# EAGLE design XstractiK_Domination_Player_Forearm_V1 (EAGLE 9.7.0)
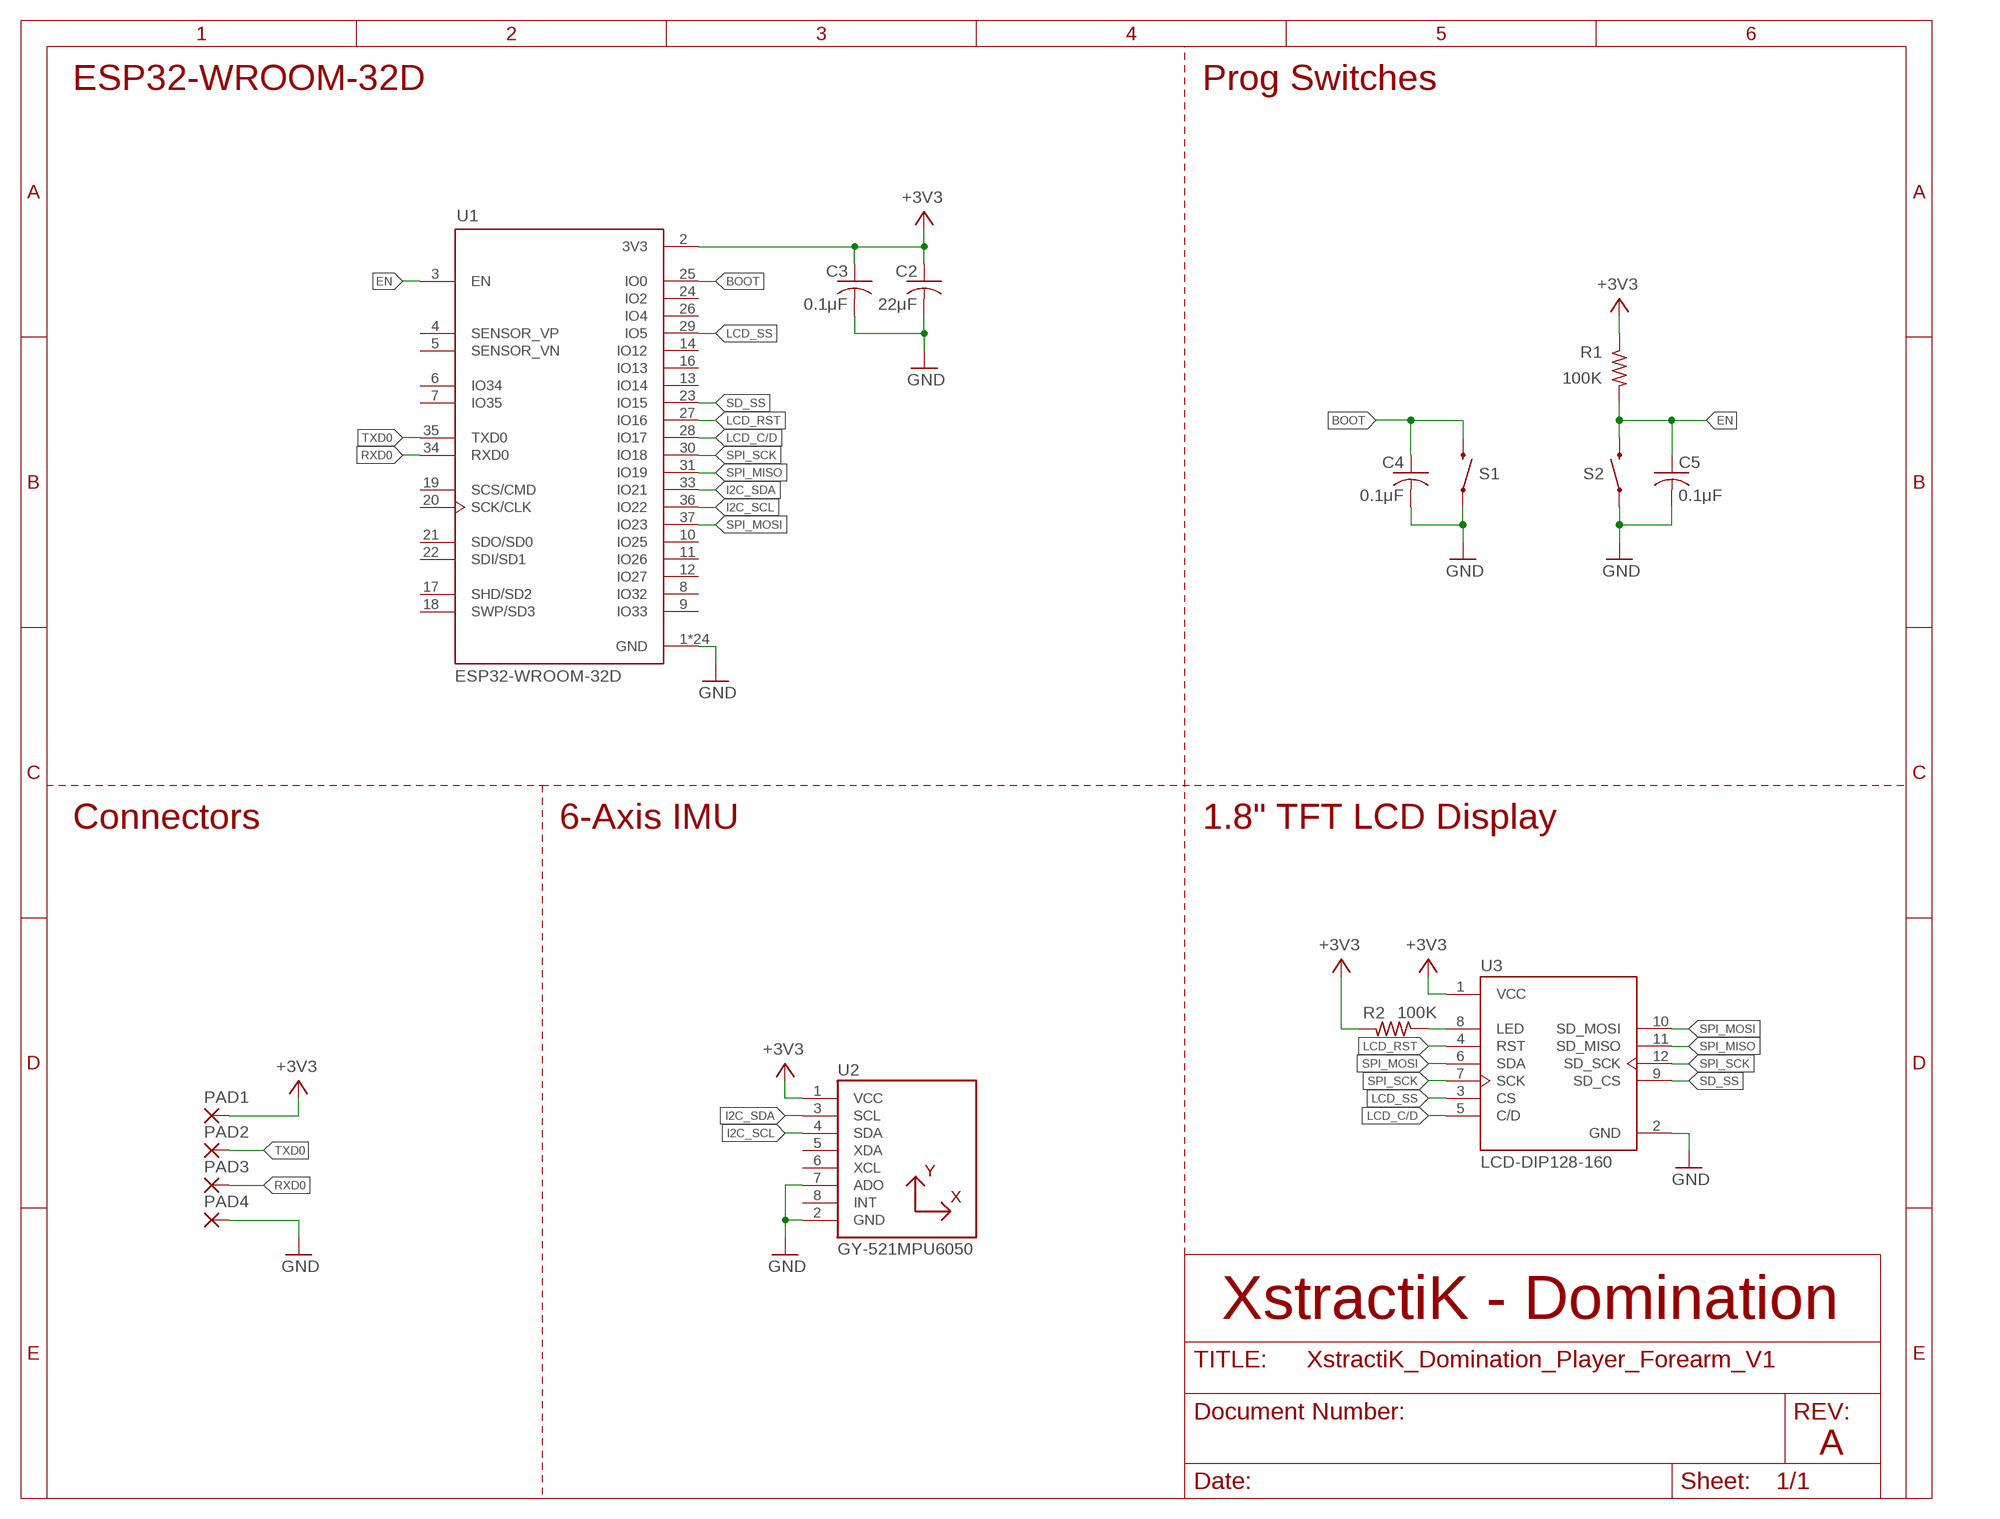
[diagram p0: schematic, sheet 1]

## Parts
C2  22μF  C-USC0805  [C0805]
C3  0.1μF  C-USC0805  [C0805]
C4  0.1μF  C-USC0805  [C0805]
C5  0.1μF  C-USC0805  [C0805]
PAD1  WIREPADSMD5-1,8  [5-1,8]
PAD2  WIREPADSMD5-1,8  [5-1,8]
PAD3  WIREPADSMD5-1,8  [5-1,8]
PAD4  WIREPADSMD5-1,8  [5-1,8]
R1  100K  R-US_R0805  [R0805]
R2  100K  R-US_R0805  [R0805]
S1  MOMENTARY-SWITCH-SPST-SMD-5.2MM-TALL  [TACTILE_SWITCH_SMD_5.2MM]
S2  MOMENTARY-SWITCH-SPST-SMD-5.2MM-TALL  [TACTILE_SWITCH_SMD_5.2MM]
U1  ESP32-WROOM-32D  [MODULE_ESP32-WROOM-32D]
U2  GY-521MPU6050  [GY-521]
U3  LCD-DIP128-160  [LCD-DIP128-160]

## Nets
+3V3: C2.1 C3.1 PAD1.1(P) R1.1 R2.2 U1.2(3V3) U2.1(VCC) U3.1(VCC)
BOOT: C4.1 S1.3 U1.25(IO0)
EN: C5.1 R1.2 S2.3 U1.3(EN)
GND: C2.2 C3.2 C4.2 C5.2 PAD4.1(P) S1.1 S2.1 U1.1(GND) U1.15(GND) U1.38(GND) U1.39_1(GND) U1.39_2(GND) U1.39_3(GND) U1.39_4(GND) U1.39_5(GND) U1.39_6(GND) U1.39_7(GND) U1.39_8(GND) U1.39_9(GND) U1.39_10(GND) U1.39_11(GND) U1.39_12(GND) U1.39_13(GND) U1.39_14(GND) U1.39_15(GND) U1.39_16(GND) U1.39_17(GND) U1.39_18(GND) U1.39_19(GND) U1.39_20(GND) U1.39_21(GND) U2.2(GND) U2.7(ADO) U3.2(GND)
I2C_SCL: U1.36(IO22) U2.4(SDA)
I2C_SDA: U1.33(IO21) U2.3(SCL)
LCD_C/D: U1.28(IO17) U3.5(C/D)
LCD_LED: R2.1 U3.8(LED)
LCD_RST: U1.27(IO16) U3.4(RST)
LCD_SS: U1.29(IO5) U3.3(CS)
RXD0: PAD3.1(P) U1.34(RXD0)
SD_SS: U1.23(IO15) U3.9(SD_CS)
SPI_MISO: U1.31(IO19) U3.11(SD_MISO)
SPI_MOSI: U1.37(IO23) U3.6(SDA) U3.10(SD_MOSI)
SPI_SCK: U1.30(IO18) U3.7(SCK) U3.12(SD_SCK)
TXD0: PAD2.1(P) U1.35(TXD0)
Unconnected: U1.4(SENSOR_VP) U1.5(SENSOR_VN) U1.6(IO34) U1.7(IO35) U1.8(IO32) U1.9(IO33) U1.10(IO25) U1.11(IO26) U1.12(IO27) U1.13(IO14) U1.14(IO12) U1.16(IO13) U1.17(SHD/SD2) U1.18(SWP/SD3) U1.19(SCS/CMD) U1.20(SCK/CLK) U1.21(SDO/SD0) U1.22(SDI/SD1) U1.24(IO2) U1.26(IO4) U2.5(XDA) U2.6(XCL) U2.8(INT)

## Notes on the sheet
- ESP32-WROOM-32D | Prog Switches
- Connectors | 6-Axis IMU | 1.8" TFT LCD Display
- XstractiK - Domination
- A

## Library data of the parts
C2-C5 = rcl:C-US: CAPACITOR, American symbol; SPICEPREFIX: C
PAD1-PAD4 = wirepad:WIREPAD: Wire PAD connect wire on PCB
R1 R2 = rcl:R-US_: RESISTOR, American symbol; SPICEPREFIX: R
S1 S2 = Switches:MOMENTARY-SWITCH-SPST: Momentary Switch (Pushbutton) - SPST Normally-open (NO) SPST momentary switches (buttons, pushbuttons). Variants PTH-12MM - 12mm square, through-hole Momentary Pushbutton Switch - 12mm Square <https://www.sparkfun.com/products/9190> (COM-09190) PTH-6.0MM, PTH-6.0MM-KIT - 6.0mm square, through-hole Mini Pushbutton Switch <https://www.sparkfun.com/products/97> (COM-00097) KIT package intended for soldering kit's - only one side of pads' copper is exposed. PTH-RIGHT-ANGLE-KIT - Right-angle, through-hole Right Angle Tactile Button <https://www.sparkfun.com/products/10791> - Used on SparkFun BigTime Watch Kit <https://www.sparkfun.com/products/11734> SMD-12MM - 12mm square, surface-mount Tactile Button - SMD (12mm) <https://www.sparkfun.com/products/12993> (COM-12993) Used on SparkFun PicoBoard <https://www.sparkfun.com/products/11888> SMD-4.5MM - 4.5mm Square Trackball Switch Used on SparkFun Blackberry Trackballer Breakout <https://www.sparkfun.com/products/13169> SMD-4.6MMX2.8MM - 4.60mm x 2.80mm, surface mount Used on SparkFun Pro Micro - RP2040 <https://www.sparkfun.com/products/17717> SMD-5.2MM, SMD-5.2-REDUNDANT - 5.2mm square, surface-mount Mini Pushbutton Switch - SMD <https://www.sparkfun.com/products/8720> (COM-08720) Used on Arduino Pro Mini <https://www.sparkfun.com/products/11114> REDUNDANT package connects both switch circuits together SMD-6.0X3.5MM - 6.0 x 3.5mm, surface mount Momentary Reset Switch SMD <https://www.sparkfun.com/products/8229> (COM-08229) SMD-6.2MM-TALL - 6.2mm square, surface mount Tactile Button - SMD (6mm) <https://www.sparkfun.com/products/12992> Used on SparkFun Digital Sandbox <https://www.sparkfun.com/products/12651> SMD-RIGHT-ANGLE - Right-angle, surface mount Used on SparkFun Block for Intel® Edison - Arduino <https://www.sparkfun.com/products/13036>; PROD_ID: SWCH-14139
U1 = ESP32-WROOM-32D:ESP32-WROOM-32D: Bluetooth, WiFi 802.11b/g/n, Bluetooth v4.2 + EDR, Class 1, 2 and 3 Transceiver Module 2.4GHz ~ 2.5GHz Integrated, Trace Surface Mount Check availability <https://pricing.snapeda.com/parts/ESP32-WROOM-32D/Espressif%20Systems/view-part?ref=eda>; AVAILABILITY: In Stock; DESCRIPTION: Bluetooth, WiFi 802.11b/g/n, Bluetooth v4.2 +EDR, Class 1, 2 and 3 Transceiver Module 2.4GHz ~ 2.5GHz Integrated; MF: Espressif Systems; MP: ESP32-WROOM-32D; PACKAGE: Module Espressif Systems; PRICE: None; PURCHASE-URL: https://pricing.snapeda.com/search/part/ESP32-WROOM-32D/?ref=eda
U2 = MPU6050:GY-521: GY-521 PIM for MPU6050 Check availability <https://pricing.snapeda.com/parts/GY-521/GODREAM%20FORDREAM%20CO.%2C%20LIMITED/view-part?ref=eda>; AVAILABILITY: Not in stock; DESCRIPTION: Triple Axis Accelerometer Gyro Breakout; MF: GODREAM FORDREAM CO., LIMITED; MP: GY-521; PACKAGE: Package; PRICE: None
U3 = TFT-LCD:LCD-DIP128-160: TFT LCD Display

## Board
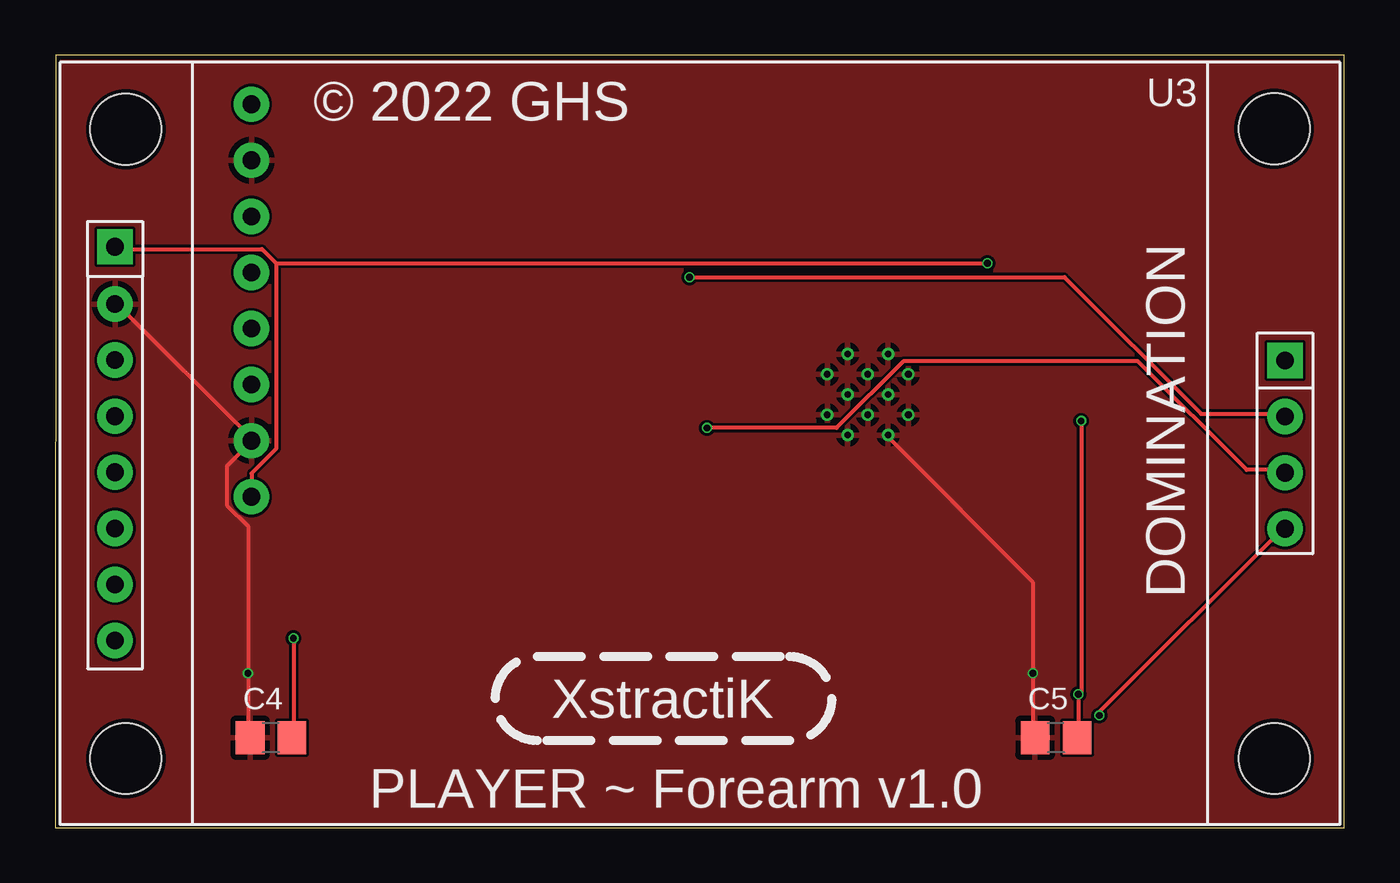
[diagram p1: board, top side]
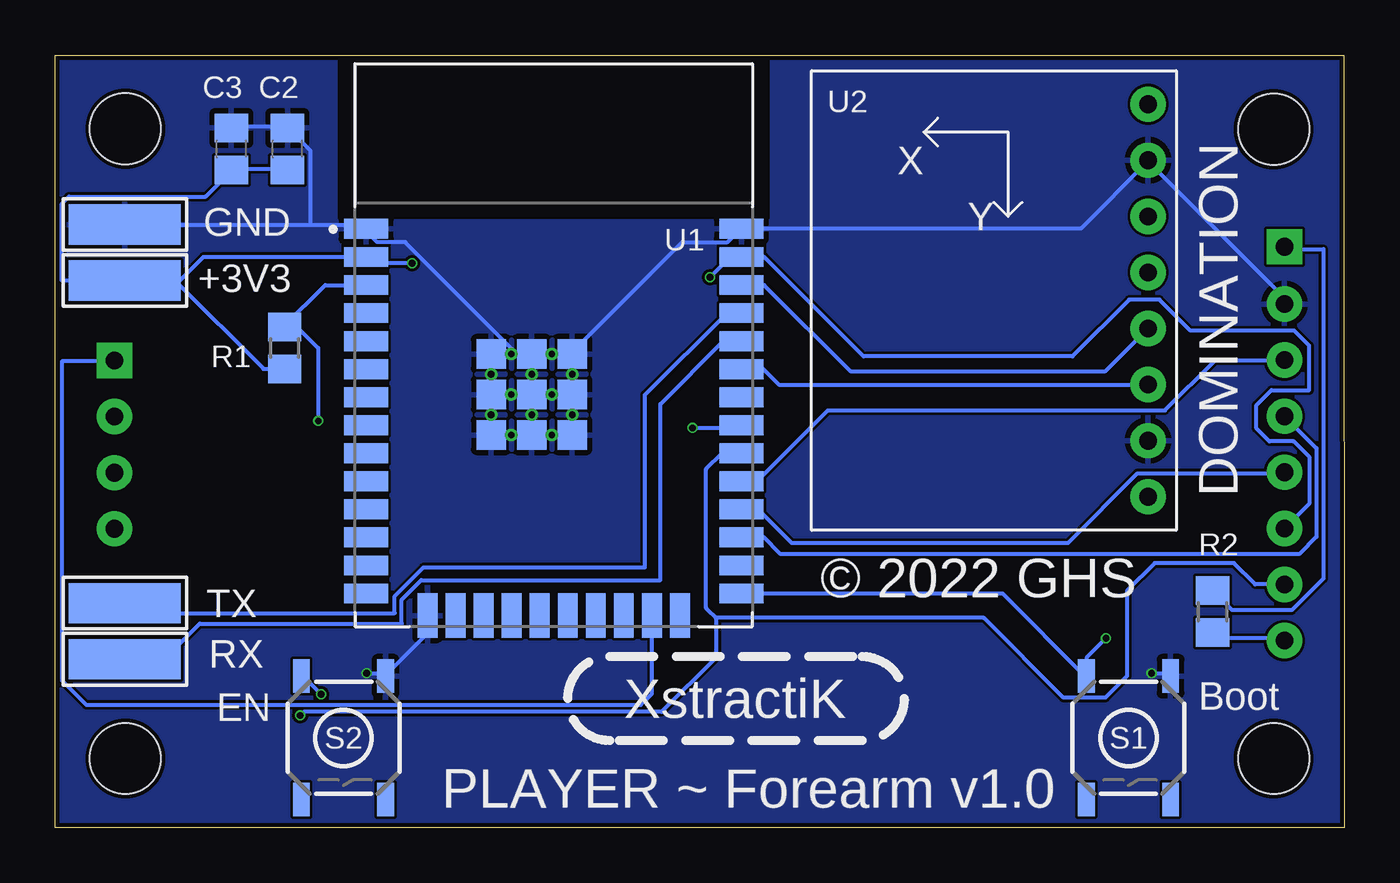
[diagram p2: board, bottom side, seen from below]

Size 58.4 x 34.98 mm. Coordinates in mm from the lower left corner, seen from the top.
Outline: 0,0 58.4,0 58.4,34.98 0.03,34.98 0,0
Copper layers (1*16): Top 0.035559375mm / dielectric 1.6mm / Bottom 0.035559375mm
Design rules "jlcpcb2layer *": minimum track width 7mil, minimum drill 12mil, track to track 5mil, track to pad 5mil, pad to pad 5mil, via to via 5mil, smd to smd 5mil, copper to edge 8mil, drill to drill 6mil, minimum pad ring 5mil, minimum via ring 3mil, stop-mask expansion 2.5mil, vias tented up to drill 0mil, thermal gap 10mil
bRestrict: area 26,27.6 to 45.6,34.8

### Footprints (pad centres in the part's own frame; a part is rotated, then mirrored left to right if it is on the bottom)
C0805 = smd 1.3 x 1.5: 1 -0.95,0; 2 0.95,0
5-1,8 = smd 1.829 x 5.08: 1 0,0
R0805 = smd 1.3 x 1.5: 1 -0.95,0; 2 0.95,0
TACTILE_SWITCH_SMD_5.2MM = smd 1.524 x 0.762: 1 -2.794,1.905; 2 2.794,1.905; 3 -2.794,-1.905; 4 2.794,-1.905
MODULE_ESP32-WROOM-32D = smd 2 x 0.9: 1 -8.5,5.26; 2 -8.5,3.99; 3 -8.5,2.72; 4 -8.5,1.45; 5 -8.5,0.18; 6 -8.5,-1.09; 7 -8.5,-2.36; 8 -8.5,-3.63; 9 -8.5,-4.9; 10 -8.5,-6.17; 11 -8.5,-7.44; 12 -8.5,-8.71; 13 -8.5,-9.98; 14 -8.5,-11.25; 25 8.5,-11.25; 26 8.5,-9.98; 27 8.5,-8.71; 28 8.5,-7.44; 29 8.5,-6.17; 30 8.5,-4.9; 31 8.5,-3.63; 32 8.5,-2.36; 33 8.5,-1.09; 34 8.5,0.18; 35 8.5,1.45; 36 8.5,2.72; 37 8.5,3.99; 38 8.5,5.26 | smd 0.9 x 2: 15 -5.715,-12.25; 16 -4.445,-12.25; 17 -3.175,-12.25; 18 -1.905,-12.25; 19 -0.635,-12.25; 20 0.635,-12.25; 21 1.905,-12.25; 22 3.175,-12.25; 23 4.445,-12.25; 24 5.715,-12.25 | smd 1.33 x 1.33: 39_1 -2.835,-0.405; 39_2 -1,-0.405; 39_3 0.835,-0.405; 39_4 -2.835,-2.24; 39_5 -1,-2.24; 39_6 0.835,-2.24; 39_7 -2.835,-4.075; 39_8 -1,-4.075; 39_9 0.835,-4.075 | drill 0.305 pad 0.508: 39_10 -1.917,-0.405; 39_11 -0.083,-0.405; 39_12 -2.835,-1.323; 39_13 -1,-1.323; 39_14 0.835,-1.323; 39_15 -1.917,-2.24; 39_16 -0.083,-2.24; 39_17 -2.835,-3.158; 39_18 -1,-3.158; 39_19 0.835,-3.158; 39_20 -1.917,-4.075; 39_21 -0.083,-4.075
GY-521 = drill 0.8 pad 1.6: 1 -6.985,8.89; 2 -6.985,6.35; 3 -6.985,3.81; 4 -6.985,1.27; 5 -6.985,-1.27; 6 -6.985,-3.81; 7 -6.985,-6.35; 8 -6.985,-8.89
LCD-DIP128-160 = drill 0.8 pad 1.6 square: 1 -26.75,8.9; 9 26.25,3.75 | drill 0.8 pad 1.6: 2 -26.75,6.31; 3 -26.75,3.77; 4 -26.75,1.23; 5 -26.75,-1.31; 6 -26.75,-3.85; 7 -26.75,-6.39; 8 -26.75,-8.93; 10 26.25,1.21; 11 26.25,-1.33; 12 26.25,-3.87 | hole 3.2: -26.264,14.224; 25.756,14.249; -26.264,-14.275; 25.756,-14.275

### Placement (x,y rotation side)
C2  47.88,30.73 90 bottom
C3  50.42,30.73 90 bottom
C4  9.78,4.06 180 top
C5  45.34,4.06 180 top
PAD1  55.24,24.77 270 bottom
PAD2  55.24,10.16 90 bottom
PAD3  55.24,7.62 270 bottom
PAD4  55.24,27.3 270 bottom
R1  48.01,21.72 90 bottom
R2  5.97,9.78 90 bottom
S1  9.78,4.06 270 bottom
S2  45.34,4.06 270 bottom
U1  35.81,21.85 0 bottom
U2  15.88,23.87 180 bottom
U3  29.46,17.4 0 top

### Tracks (layer width: path | path; a pad name or v marks a point on that pad's centre or on a via)
+3V3  (via drill 0.3)
  Top 0.178: U2.1 8.89,16.03 10,17.14 10,25.56 | 10,25.56 9.37,26.19 2.86,26.19 U3.1 | 10,25.56 v42.23,25.56
  Bottom 0.178: C2.1 47.94,29.84 50.32,29.84 C3.1 50.48,29.69 51.59,28.57 57.78,28.57 58.1,28.26 58.1,24.77 PAD1.1 53.01,24.77 52.96,24.77 | 52.96,24.77 48.96,20.77 R1.1 | 52.96,24.77 52.75,24.77 51.68,25.84 U1.2 44.29,25.72 44.13,25.56 v42.23,25.56 | R2.2 5.87,10.64 5.08,9.84 2.38,9.84 0.95,11.27 0.95,26.19 2.7,26.19 U3.1
BOOT  (via drill 0.3)
  Top 0.178: v10.79,8.57 10.79,4.13 C4.1
  Bottom 0.178: v10.79,8.57 11.68,7.68 S1.3 11.75,6.86 15.49,10.6 U1.25
EN  (via drill 0.3)
  Top 0.178: C5.1 46.35,4.13 v46.35,6.03 46.48,6.16 v46.48,18.41
  Bottom 0.178: v46.35,6.03 47.15,6.83 S2.3 | v46.48,18.41 46.48,21.71 47.44,22.67 R1.2 48.06,22.67 46.16,24.57 U1.3
GND  (via drill 0.3)
  Top 0.178: C4.2 8.73,4.13 v8.73,6.99 8.73,13.65 7.78,14.61 7.78,16.35 8.89,17.46 U2.2 8.89,17.62 2.86,23.65 U3.2 | C5.2 44.29,4.13 v44.29,6.99 44.29,11.11 37.78,17.62 U1.39_20
  Bottom 0.178: v8.73,6.99 7.94,6.99 S1.1 | 8.89,30.16 2.86,24.13 2.86,23.81 U3.2 | C3.2 50.32,31.75 47.94,31.75 C2.2 47.78,31.59 46.83,30.64 46.83,27.3 | PAD4.1 46.83,27.3 | 46.83,27.3 44.61,27.3 44.45,27.15 U1.1 44.29,26.99 43.81,26.51 42.55,26.51 37.62,21.59 U1.39_10 | U1.39_11 36.04,21.59 36.67,21.59 U1.39_2 36.83,21.43 | 36.83,21.43 36.83,20.64 U1.39_13 36.83,20.48 36.83,19.68 U1.39_5 | U1.39_16 36.04,19.68 36.67,19.68 U1.39_5 | U1.39_5 36.83,19.53 36.83,18.73 U1.39_18 36.83,18.57 36.83,17.78 U1.39_8 36.67,17.78 36.04,17.78 U1.39_21 35.88,17.78 35.08,17.78 | 35.08,17.78 35.08,18.57 U1.39_19 35.08,18.73 35.08,19.53 U1.39_6 35.08,19.68 35.08,20.48 U1.39_14 35.08,20.64 35.08,21.43 U1.39_3 34.92,21.59 30,26.51 27.94,26.51 27.46,26.99 U1.38 27.3,27.15 11.91,27.15 8.89,30.16 | 35.08,17.78 U1.39_9 | U1.15 41.59,9.53 41.59,8.73 43.34,6.99 S2.1 43.5,6.99 v44.29,6.99 | U1.39_10 37.78,21.59 38.58,21.59 U1.39_1 38.73,21.43 38.73,20.64 U1.39_12 38.73,20.48 38.73,19.68 U1.39_4 | U1.39_15 37.78,19.68 38.58,19.68 U1.39_4 | U1.39_4 38.73,19.53 38.73,18.73 U1.39_17 38.73,18.57 38.73,17.78 U1.39_7 38.58,17.78 37.78,17.78 U1.39_20 | 36.83,21.43 37.62,21.43 U1.39_10 | 8.89,30.16 U2.7
  pour Top: 0.22,0.22 58.2,0.22 58.2,34.84 0.22,34.84
  pour Bottom: 0.22,0.22 58.2,0.22 58.2,34.84 0.22,34.84
I2C_SCL
  Bottom 0.178: U1.36 26.28,24.57 22.38,20.67 10.82,20.67 U2.4
I2C_SDA
  Bottom 0.178: U1.33 26.32,20.76 25.62,20.06 U2.3
LCD_C/D
  Bottom 0.178: U3.5 2.86,16.03 9.37,16.03 12.52,12.88 25.03,12.88 26.55,14.41 U1.28
LCD_LED
  Bottom 0.178: R2.1 5.87,8.73 5.71,8.57 2.86,8.57 U3.8
LCD_RST
  Bottom 0.178: U1.27 26.3,13.14 25.54,12.38 2.04,12.38 1.27,13.16 1.27,17.18 U3.4
LCD_SS
  Bottom 0.178: U1.29 26.61,15.68 23.4,18.89 8.13,18.89 5.85,21.17 U3.3
RXD0
  Bottom 0.178: PAD3.1 53.47,7.62 51.85,9.24 42.7,9.24 42.7,10.32 41.81,11.21 30.99,11.21 30.99,19.18 28.14,22.03 U1.34
SD_SS
  Bottom 0.178: U3.9 55.72,21.11 58.1,21.11 58.1,6.67 56.99,5.56 31.88,5.56 31.37,6.07 U1.23
SPI_MISO  (via drill 0.3)
  Top 0.178: v29.53,18.1 35.4,18.1 38.42,21.11 49.05,21.11 53.98,16.19 55.56,16.19 U3.11
  Bottom 0.178: v29.53,18.1 27.46,18.1 U1.31
SPI_MOSI  (via drill 0.3)
  Top 0.178: v28.73,24.92 45.72,24.92 51.91,18.73 55.56,18.73 U3.10
  Bottom 0.178: v28.73,24.92 27.94,25.72 27.46,25.72 U1.37 26.28,25.84 21.78,21.34 12.32,21.34 9.75,23.91 8.37,23.91 6.97,22.5 2.27,22.5 1.59,21.82 1.59,19.81 3.3,19.81 3.98,19.13 3.98,18.08 3.39,17.49 2.29,17.49 1.57,16.76 1.57,14.69 U3.6
SPI_SCK  (via drill 0.3)
  Top 0.178: v47.31,5.08 47.31,5.24 55.56,13.49 U3.12
  Bottom 0.178: v47.31,5.08 47.15,5.24 30.92,5.24 28.45,7.71 28.45,9.47 28.47,9.49 | U3.7 4.04,11.01 5,11.98 8.59,11.98 9.84,10.72 9.84,6.86 10.82,5.88 12.72,5.88 16.34,9.49 28.47,9.49 | U1.30 28.2,16.95 28.91,16.24 28.91,9.93 28.83,9.85 28.47,9.49
TXD0
  Bottom 0.178: PAD2.1 54.8,9.72 43.02,9.72 43.02,10.48 41.72,11.78 31.69,11.78 31.69,19.59 27.98,23.3 U1.35

### Text on the board
tPlace: © 2022 GHS | DOMINATION | XstractiK | PLAYER ~ Forearm v1.0
bPlace: GND | +3V3 | DOMINATION | © 2022 GHS | TX | RX | EN | Boot | XstractiK | PLAYER ~ Forearm v1.0